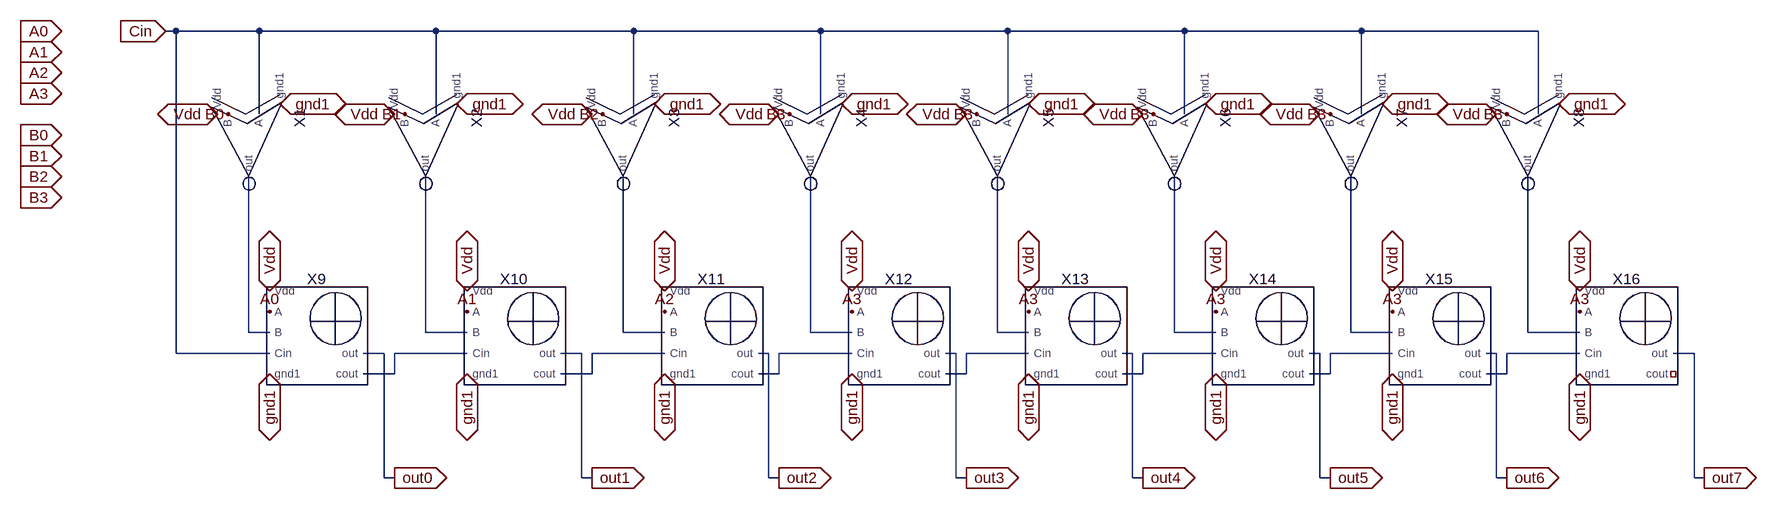
[diagram p0: schematic AddSub.asc]
AddSub.asc, the LTspice schematic file:
Version 4.1
SHEET 1 2544 760
WIRE 64 0 48 0
WIRE 192 0 64 0
WIRE 464 0 192 0
WIRE 768 0 464 0
WIRE 1056 0 768 0
WIRE 1344 0 1056 0
WIRE 1616 0 1344 0
WIRE 1888 0 1616 0
WIRE 2160 0 1888 0
WIRE 192 128 192 0
WIRE 464 128 464 0
WIRE 768 128 768 0
WIRE 1056 128 1056 0
WIRE 1344 128 1344 0
WIRE 1616 128 1616 0
WIRE 1888 128 1888 0
WIRE 2160 128 2160 0
WIRE 176 464 176 224
WIRE 208 464 176 464
WIRE 448 464 448 224
WIRE 512 464 448 464
WIRE 752 464 752 224
WIRE 816 464 752 464
WIRE 1040 464 1040 224
WIRE 1104 464 1040 464
WIRE 1328 464 1328 224
WIRE 1376 464 1328 464
WIRE 1600 464 1600 224
WIRE 1664 464 1600 464
WIRE 1872 464 1872 224
WIRE 1936 464 1872 464
WIRE 2144 464 2144 224
WIRE 2224 464 2144 464
WIRE 64 496 64 0
WIRE 208 496 64 496
WIRE 384 496 352 496
WIRE 512 496 400 496
WIRE 688 496 656 496
WIRE 816 496 704 496
WIRE 976 496 960 496
WIRE 1104 496 992 496
WIRE 1264 496 1248 496
WIRE 1376 496 1280 496
WIRE 1536 496 1520 496
WIRE 1664 496 1552 496
WIRE 1824 496 1808 496
WIRE 1936 496 1840 496
WIRE 2096 496 2080 496
WIRE 2224 496 2112 496
WIRE 2400 496 2368 496
WIRE 400 528 400 496
WIRE 400 528 352 528
WIRE 704 528 704 496
WIRE 704 528 656 528
WIRE 992 528 992 496
WIRE 992 528 960 528
WIRE 1280 528 1280 496
WIRE 1280 528 1248 528
WIRE 1552 528 1552 496
WIRE 1552 528 1520 528
WIRE 1840 528 1840 496
WIRE 1840 528 1808 528
WIRE 2112 528 2112 496
WIRE 2112 528 2080 528
WIRE 384 688 384 496
WIRE 400 688 384 688
WIRE 688 688 688 496
WIRE 704 688 688 688
WIRE 976 688 976 496
WIRE 992 688 976 688
WIRE 1264 688 1264 496
WIRE 1280 688 1264 688
WIRE 1536 688 1536 496
WIRE 1552 688 1536 688
WIRE 1824 688 1824 496
WIRE 1840 688 1824 688
WIRE 2096 688 2096 496
WIRE 2112 688 2096 688
WIRE 2400 688 2400 496
WIRE 2416 688 2400 688
FLAG -112 0 A0
IOPIN -112 0 In
FLAG -112 32 A1
IOPIN -112 32 In
FLAG -112 64 A2
IOPIN -112 64 In
FLAG -112 96 A3
IOPIN -112 96 In
FLAG -112 160 B0
IOPIN -112 160 In
FLAG -112 192 B1
IOPIN -112 192 In
FLAG -112 224 B2
IOPIN -112 224 In
FLAG -112 256 B3
IOPIN -112 256 In
FLAG 48 0 Cin
IOPIN 48 0 In
FLAG 128 128 Vdd
IOPIN 128 128 BiDir
FLAG 224 112 gnd1
IOPIN 224 112 BiDir
FLAG 400 128 Vdd
IOPIN 400 128 BiDir
FLAG 496 112 gnd1
IOPIN 496 112 BiDir
FLAG 704 128 Vdd
IOPIN 704 128 BiDir
FLAG 800 112 gnd1
IOPIN 800 112 BiDir
FLAG 992 128 Vdd
IOPIN 992 128 BiDir
FLAG 1088 112 gnd1
IOPIN 1088 112 BiDir
FLAG 1280 128 Vdd
IOPIN 1280 128 BiDir
FLAG 1376 112 gnd1
IOPIN 1376 112 BiDir
FLAG 1552 128 Vdd
IOPIN 1552 128 BiDir
FLAG 1648 112 gnd1
IOPIN 1648 112 BiDir
FLAG 1824 128 Vdd
IOPIN 1824 128 BiDir
FLAG 1920 112 gnd1
IOPIN 1920 112 BiDir
FLAG 208 400 Vdd
IOPIN 208 400 BiDir
FLAG 208 528 gnd1
IOPIN 208 528 BiDir
FLAG 512 400 Vdd
IOPIN 512 400 BiDir
FLAG 512 528 gnd1
IOPIN 512 528 BiDir
FLAG 816 400 Vdd
IOPIN 816 400 BiDir
FLAG 816 528 gnd1
IOPIN 816 528 BiDir
FLAG 1104 528 gnd1
IOPIN 1104 528 BiDir
FLAG 1104 400 Vdd
IOPIN 1104 400 BiDir
FLAG 1376 400 Vdd
IOPIN 1376 400 BiDir
FLAG 1376 528 gnd1
IOPIN 1376 528 BiDir
FLAG 1664 528 gnd1
IOPIN 1664 528 BiDir
FLAG 1664 400 Vdd
IOPIN 1664 400 BiDir
FLAG 1936 400 Vdd
IOPIN 1936 400 BiDir
FLAG 1936 528 gnd1
IOPIN 1936 528 BiDir
FLAG 2096 128 Vdd
IOPIN 2096 128 BiDir
FLAG 2192 112 gnd1
IOPIN 2192 112 BiDir
FLAG 2224 400 Vdd
IOPIN 2224 400 BiDir
FLAG 2224 528 gnd1
IOPIN 2224 528 BiDir
FLAG 144 128 B0
FLAG 416 128 B1
FLAG 720 128 B2
FLAG 1008 128 B3
FLAG 1296 128 B3
FLAG 1568 128 B3
FLAG 1840 128 B3
FLAG 2112 128 B3
FLAG 208 432 A0
FLAG 512 432 A1
FLAG 816 432 A2
FLAG 1104 432 A3
FLAG 1376 432 A3
FLAG 1664 432 A3
FLAG 1936 432 A3
FLAG 2224 432 A3
FLAG 400 688 out0
IOPIN 400 688 Out
FLAG 704 688 out1
IOPIN 704 688 Out
FLAG 992 688 out2
IOPIN 992 688 Out
FLAG 1280 688 out3
IOPIN 1280 688 Out
FLAG 1552 688 out4
IOPIN 1552 688 Out
FLAG 1840 688 out5
IOPIN 1840 688 Out
FLAG 2112 688 out6
IOPIN 2112 688 Out
FLAG 2416 688 out7
IOPIN 2416 688 Out
SYMBOL XORR 176 160 R90
SYMATTR InstName X1
SYMBOL XORR 448 160 R90
SYMATTR InstName X2
SYMBOL XORR 752 160 R90
SYMATTR InstName X3
SYMBOL XORR 1040 160 R90
SYMATTR InstName X4
SYMBOL XORR 1328 160 R90
SYMATTR InstName X5
SYMBOL XORR 1600 160 R90
SYMATTR InstName X6
SYMBOL XORR 1872 160 R90
SYMATTR InstName X7
SYMBOL XORR 2144 160 R90
SYMATTR InstName X8
SYMBOL full_adder 272 464 R0
SYMATTR InstName X9
SYMBOL full_adder 576 464 R0
SYMATTR InstName X10
SYMBOL full_adder 880 464 R0
SYMATTR InstName X11
SYMBOL full_adder 1168 464 R0
SYMATTR InstName X12
SYMBOL full_adder 1440 464 R0
SYMATTR InstName X13
SYMBOL full_adder 1728 464 R0
SYMATTR InstName X14
SYMBOL full_adder 2000 464 R0
SYMATTR InstName X15
SYMBOL full_adder 2288 464 R0
SYMATTR InstName X16

The netlist it stands for:
* AddSub.asc
X§X1 Cin B0 gnd1 N001 Vdd XORR  ; pins A B gnd1 out Vdd
X§X2 Cin B1 gnd1 N002 Vdd XORR  ; pins A B gnd1 out Vdd
X§X3 Cin B2 gnd1 N003 Vdd XORR  ; pins A B gnd1 out Vdd
X§X4 Cin B3 gnd1 N004 Vdd XORR  ; pins A B gnd1 out Vdd
X§X5 Cin B3 gnd1 N005 Vdd XORR  ; pins A B gnd1 out Vdd
X§X6 Cin B3 gnd1 N006 Vdd XORR  ; pins A B gnd1 out Vdd
X§X7 Cin B3 gnd1 N007 Vdd XORR  ; pins A B gnd1 out Vdd
X§X8 Cin B3 gnd1 N008 Vdd XORR  ; pins A B gnd1 out Vdd
X§X9 A0 N001 Cin N009 gnd1 out0 Vdd full_adder  ; pins A B Cin cout gnd1 out Vdd
X§X10 A1 N002 N009 N010 gnd1 out1 Vdd full_adder  ; pins A B Cin cout gnd1 out Vdd
X§X11 A2 N003 N010 N011 gnd1 out2 Vdd full_adder  ; pins A B Cin cout gnd1 out Vdd
X§X12 A3 N004 N011 N012 gnd1 out3 Vdd full_adder  ; pins A B Cin cout gnd1 out Vdd
X§X13 A3 N005 N012 N013 gnd1 out4 Vdd full_adder  ; pins A B Cin cout gnd1 out Vdd
X§X14 A3 N006 N013 N014 gnd1 out5 Vdd full_adder  ; pins A B Cin cout gnd1 out Vdd
X§X15 A3 N007 N014 N015 gnd1 out6 Vdd full_adder  ; pins A B Cin cout gnd1 out Vdd
X§X16 A3 N008 N015 NC_01 gnd1 out7 Vdd full_adder  ; pins A B Cin cout gnd1 out Vdd
.backanno
.end